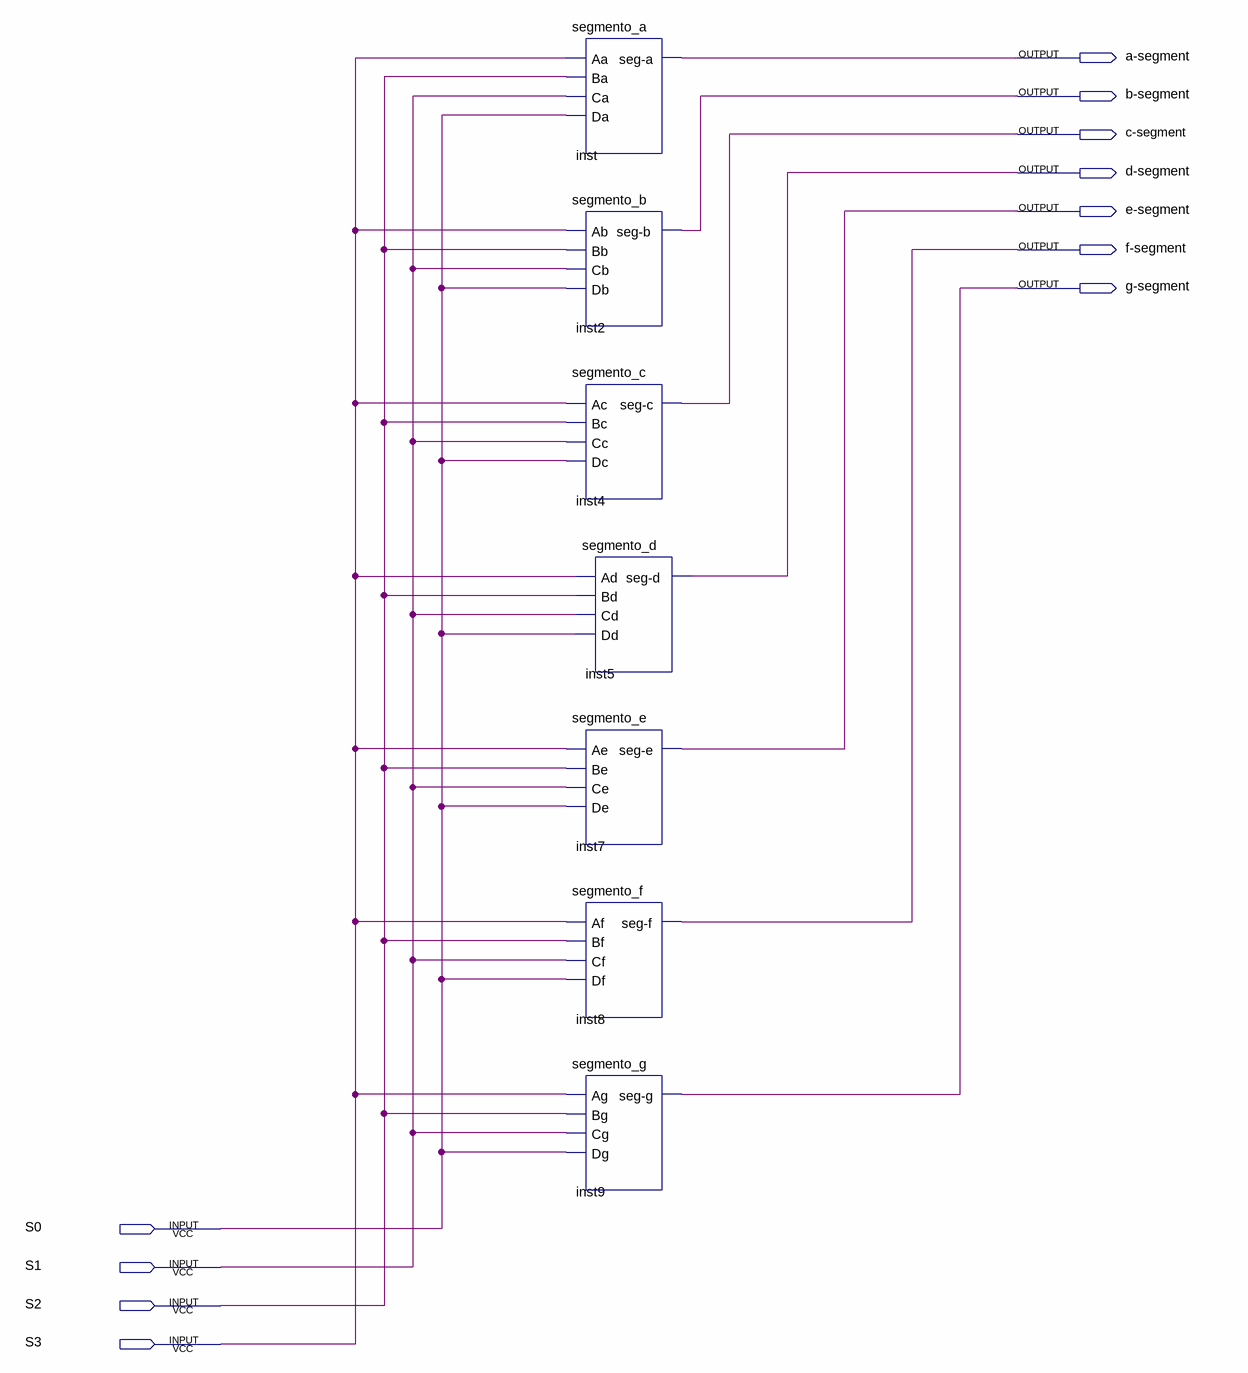
[diagram p0: schematic sheet]
// Quartus schematic conversor.bdf as structural Verilog: 7 symbols, 11 pins
module conversor (
  input  S0,
  input  S1,
  input  S2,
  input  S3,
  output \a-segment ,
  output \b-segment ,
  output \c-segment ,
  output \d-segment ,
  output \e-segment ,
  output \f-segment ,
  output \g-segment 
);

  segmento_a inst (.Aa(S3), .Ba(S2), .Ca(S1), .Da(S0), .\seg-a (\a-segment ));
  segmento_b inst2 (.Ab(S3), .Bb(S2), .Cb(S1), .Db(S0), .\seg-b (\b-segment ));
  segmento_c inst4 (.Ac(S3), .Bc(S2), .Cc(S1), .Dc(S0), .\seg-c (\c-segment ));
  segmento_d inst5 (.Ad(S3), .Bd(S2), .Cd(S1), .Dd(S0), .\seg-d (\d-segment ));
  segmento_e inst7 (.Ae(S3), .Be(S2), .Ce(S1), .De(S0), .\seg-e (\e-segment ));
  segmento_f inst8 (.Af(S3), .Bf(S2), .Cf(S1), .Df(S0), .\seg-f (\f-segment ));
  segmento_g inst9 (.Ag(S3), .Bg(S2), .Cg(S1), .Dg(S0), .\seg-g (\g-segment ));
endmodule
